# Altium schematic sheet E-29 Humidity Sensor.SchDoc: E-29 Humidity Sensor
size B; DrawnBy: Jeremie Boulianne; Organization: Synthiam Inc.; Address1: Unit 10, 6120 - 11 St. SE; Address2: Calgary, AB; Address3: T2H 2L7; Address4: Canada; Revision: 0
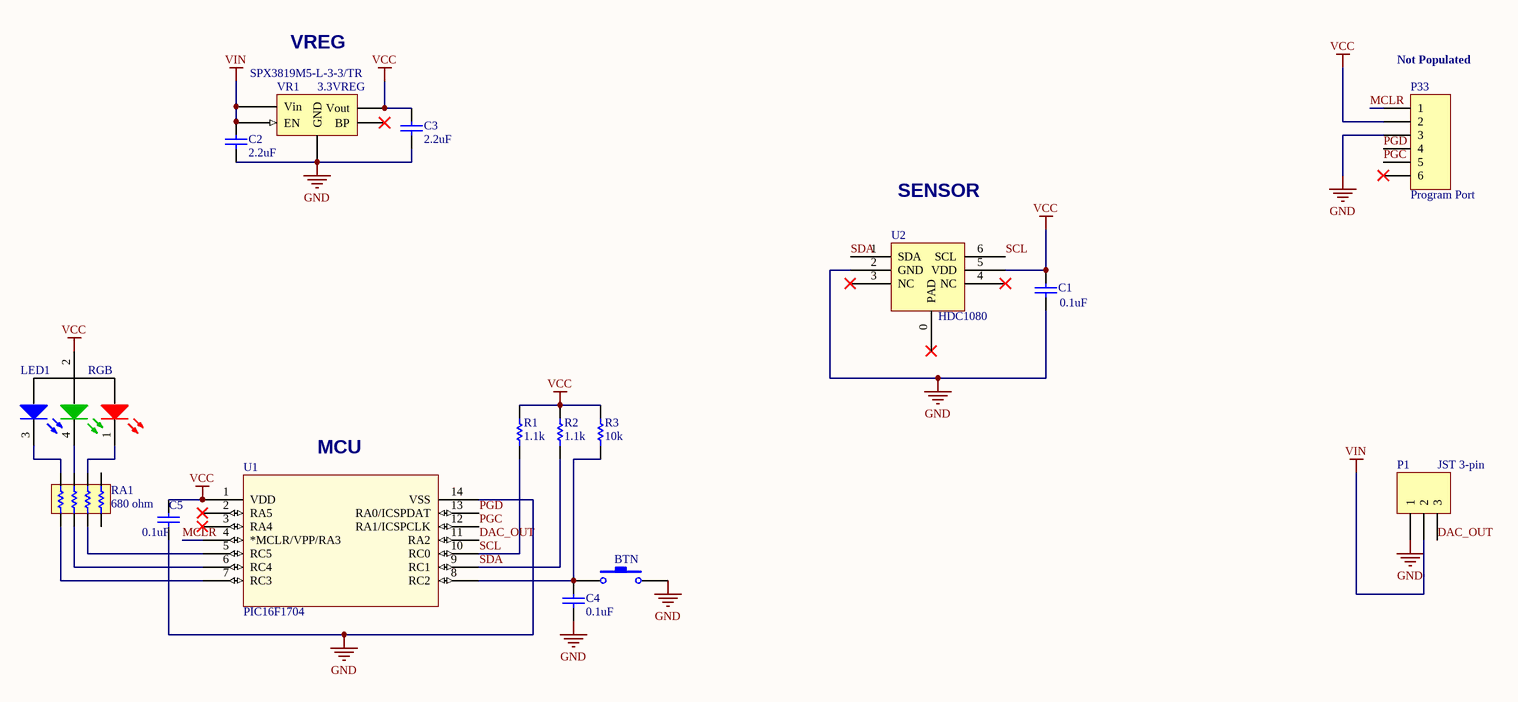
[diagram p0: E-29 Humidity Sensor.SchDoc]

## Parts
C1  value 0.1uF  [0603 TIGHT]  (hidden comment: 100nF)
C2  2.2uF  [0603 TIGHT]
C3  value 2.2uF  [0603 TIGHT]  (hidden comment: 100nF)
C4  value 0.1uF  [0603 TIGHT]  (hidden comment: 100nF)
C5  value 0.1uF  [0603 TIGHT]  (hidden comment: 100nF)
LED1  RGB  [RGBLED-CA]
P1  JST 3-pin  [JST-PH 3-pin SMD]
P33  Program Port  [HDR1X6]
R1  value 1.1k  [0603 TIGHT]  (hidden comment: 10kohm)
R2  value 1.1k  [0603 TIGHT]  (hidden comment: 10kohm)
R3  value 10k  [0603 TIGHT]  (hidden comment: 10kohm)
RA1  680 ohm  [Resistor Array 4]
S1  BTN  [SW-SMD]
U1  PIC16F1704  [TSSOP14]
U2  HDC1080  [HDC1080]
VR1  3.3VREG  [SOT-25 New]

## Nets
GND: C1.2 C2.2 C3.2 C4.2 C5.2 P1.1 P33.3 S1.2 U1.14(VSS) U2.2(GND) VR1.3(GND)
VCC: C1.1 C3.1 C5.1 LED1.2 P33.2 R1.2 R2.2 R3.2 U1.1(VDD) U2.5(VDD) VR1.2(Vout)
VIN: C2.1 P1.2 VR1.4(EN) VR1.5(Vin)
DAC_OUT: P1.3 U1.11(RA2)
MCLR: P33.1 U1.4(*MCLR/VPP/RA3)
PGC: P33.5 U1.12(RA1/ICSPCLK)
PGD: P33.4 U1.13(RA0/ICSPDAT)
SCL: R1.1 U1.10(RC0) U2.6(SCL)
SDA: R2.1 U1.9(RC1) U2.1(SDA)
NetC4_1: C4.1 R3.1 S1.1 U1.8(RC2)
NetLED1_1: LED1.1 RA1.6
NetLED1_3: LED1.3 RA1.2
NetLED1_4: LED1.4 RA1.4
NetRA1_1: RA1.1 U1.7(RC3)
NetRA1_3: RA1.3 U1.6(RC4)
NetRA1_5: RA1.5 U1.5(RC5)

Not connected (* = marked no-connect by the designer): P33 6*; RA1 7 8; U1 2(RA5)* 3(RA4)*; U2 0(PAD)* 3(NC)* 4(NC)*; VR1 1(BP)*

## Notes on the sheet
- (near VR1) VREG
- (near P33) Not Populated
- SENSOR
- (near U1) MCU
- Labels drawn without touching a wire or pin: SPX3819M5-L-3-3/TR
- Property of:
- Size:
- Date:
- B
- Drawn By:
- Time:
- Revision:
- Copyright © 2019 Synthiam Inc. All rights reserved.

## Library data of the parts
C1-C5 = Cap: Capacitor; Published: 8-Jun-2000; LatestRevisionDate: 17-Jul-2002; LatestRevisionNote: Re-released for DXP Platform.; PackageReference: RAD-0.3; Publisher: Altium Limited
  C2: Value: 2.2uF
LED1 = RGBLED-CA
P1 = Header 3: Header, 3-Pin; LatestRevisionDate: 17-Jul-2002; LatestRevisionNote: Re-released for DXP Platform.; Publisher: Altium Limited
P33 = Header 6: Header, 6-Pin; LatestRevisionDate: 17-Jul-2002; LatestRevisionNote: Re-released for DXP Platform.; Publisher: Altium Limited
R1-R3 = Res1: Resistor; Published: 8-Jun-2000; LatestRevisionDate: 17-Jul-2002; LatestRevisionNote: Re-released for DXP Platform.; PackageReference: AXIAL-0.3; Publisher: Altium Limited
RA1 = Resistor Array 4
S1 = SW-SMD
VR1 = Vreg SOT25